# Altium schematic sheet P5650.925_SchematicSheet1.SchDoc
size A3; SheetNumber: 2; SheetTotal: 3
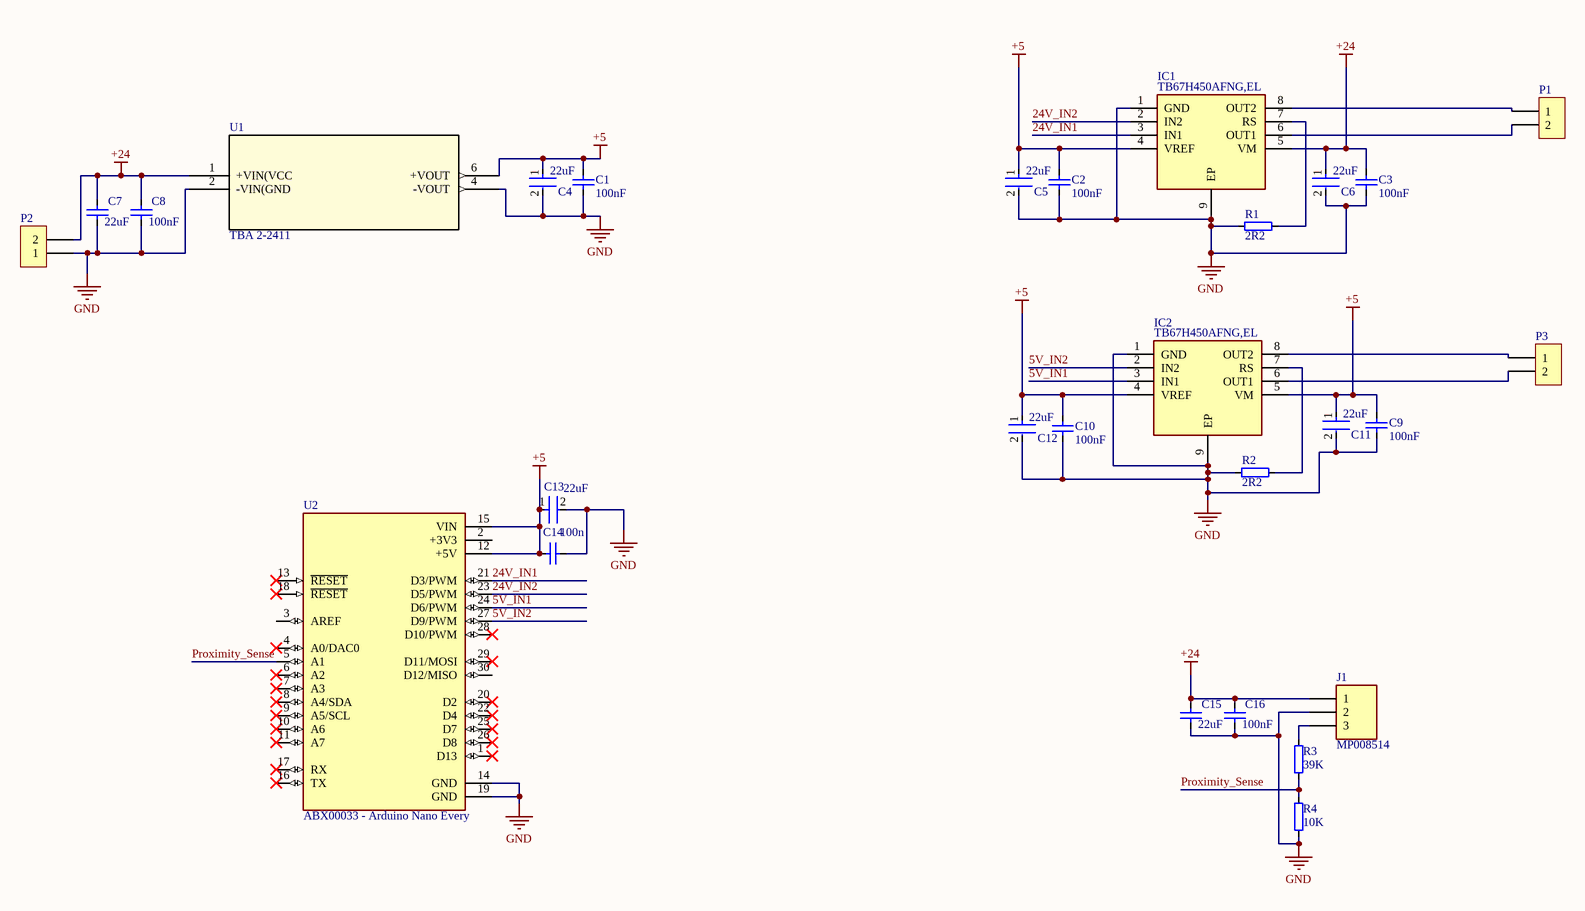
[diagram p0: P5650.925_SchematicSheet1.SchDoc]

## Parts
C1  value 100nF  [0603C]  (hidden comment: CAP 100n 10% 16V 0603 C X7R)
C2  value 100nF  [0603C]  (hidden comment: CAP 100n 10% 16V 0603 C X7R)
C3  value 100nF  [0603C Full Silk]  (hidden comment: CAP 100n 10% 50V 0603 X7R)
C4  22uF  [FP-C2012-125-0_2-IPC_A]
C5  22uF  [FP-C2012-125-0_2-IPC_A]
C6  22uF  [FP-C2012-125-0_2-IPC_A]
C7  value 22uF  [1210C]  (hidden comment: CAP 22u 20% 25V 1210 X7R)
C8  value 100nF  [0603C]  (hidden comment: CAP 100n 10% 16V 0603 C X7R)
C9  value 100nF  [0603C]  (hidden comment: CAP 100n 10% 16V 0603 C X7R)
C10  value 100nF  [0603C]  (hidden comment: CAP 100n 10% 16V 0603 C X7R)
C11  22uF  [FP-C2012-125-0_2-IPC_A]
C12  22uF  [FP-C2012-125-0_2-IPC_A]
C13  22uF  [FP-C2012-125-0_2-IPC_A]
C14  value 100n  [0603C]  (hidden comment: CAP 100n 10% 16V 0603 C X7R)
C15  value 22uF  [1210C]  (hidden comment: CAP 22u 20% 25V 1210 X7R)
C16  value 100nF  [0603C]  (hidden comment: CAP 100n 10% 16V 0603 C X7R)
IC1  TB67H450AFNG,EL  [TB67H450AFNG,EL -Motor driver-Footprint-1]
IC2  TB67H450AFNG,EL  [TB67H450AFNG,EL -Motor driver-Footprint-1]
J1  MP008514  [3 Way Screw terminal block - MP008514-Footprint-1]
P1  Con 2Way 3.81mm Screw Terminal  [Con 2Way 3.81mm Screw Terminal-Footprint-1]  (value not drawn)
P2  Con 2Way 3.81mm Screw Terminal  [Con 2Way 3.81mm Screw Terminal-Footprint-1]  (value not drawn)
P3  Con 2Way 3.81mm Screw Terminal  [Con 2Way 3.81mm Screw Terminal-Footprint-1]  (value not drawn)
R1  value 2R2  [2010/2512R]  (hidden comment: RES 2R2 5% 1W 2012 TK 200p)
R2  value 2R2  [2010/2512R]  (hidden comment: RES 2R2 5% 1W 2012 TK 200p)
R3  value 39K  [0603R]  (hidden comment: RES 39k 1% 0.1W 0603)
R4  value 10K  [0603R_IS]  (hidden comment: RES 10K 1% 0.1W 0603)
U1  TBA 2-2411  [TBA 2_SINGLE_TRP]
U2  ABX00033 - Arduino Nano Every  [MODULE_ABX00028]

## Nets
+5: C1.2 C2.2 C4.1 C5.1 C9.2 C10.2 C11.1 C12.1 C13.1 C14.2 IC1.4(VREF) IC2.4(VREF) IC2.5(VM) U1.6(+VOUT) U2.12(+5V) U2.15(VIN)
+24: C3.2 C6.1 C7.2 C8.2 C15.2 C16.2 IC1.5(VM) J1.1 P2.2 U1.1(+VIN(VCC)
GND: C1.1 C2.1 C3.1 C4.2 C5.2 C6.2 C7.1 C8.1 C9.1 C10.1 C11.2 C12.2 C13.2 C14.1 C15.1 C16.1 IC1.1(GND) IC1.9(EP) IC2.1(GND) IC2.9(EP) J1.2 P2.1 R1.1 R2.1 R4.1 U1.2(-VIN(GND) U1.4(-VOUT) U2.14(GND) U2.19(GND)
5V_IN1: IC2.3(IN1) U2.24(D6/PWM)
5V_IN2: IC2.2(IN2) U2.27(D9/PWM)
24V_IN1: IC1.3(IN1) U2.21(D3/PWM)
24V_IN2: IC1.2(IN2) U2.23(D5/PWM)
Proximity_Sense: R3.2 R4.2 U2.5(A1)
NetIC1_6: IC1.6(OUT1) P1.2
NetIC1_7: IC1.7(RS) R1.2
NetIC1_8: IC1.8(OUT2) P1.1
NetIC2_6: IC2.6(OUT1) P3.2
NetIC2_7: IC2.7(RS) R2.2
NetIC2_8: IC2.8(OUT2) P3.1
NetJ1_3: J1.3 R3.1

Not connected (* = marked no-connect by the designer): U2 1(D13)* 2(+3V3) 3(AREF) 4(A0/DAC0)* 6(A2)* 7(A3)* 8(A4/SDA)* 9(A5/SCL)* 10(A6)* 11(A7)* 13(~{RESET})* 16(TX)* 17(RX)* 18(~{RESET})* 20(D2)* 22(D4)* 25(D7)* 26(D8)* 28(D10/PWM)* 29(D11/MOSI)* 30(D12/MISO)

## Notes on the sheet
- Client / Project
- Issue
- ECR
- Number
- Title
- Date
- App'd
- Sheet
- Must Not Be Modified
- Without Authorisation
- Certification Drawing
- Values shown are typical, see BOM table for certification details
- !
- DENOTES SAFETY COMPONENT
- Dr'n
- TROLEX Ltd
- Newby Road, Stockport, Cheshire SK7 5DY  U.K.
- Ch'kd
- Tel: +44 (0)161-483-1435  Web:www.trolex.com  Email: info@trolex.com
- No.
- Of

## Library data of the parts
C1 C2 C8-C10 C14 C16 = CMP-001-00021-1: Part Number: S890.0055; Certification Footprint: 0603; Certification Field 3: nF; Certification Field 1: Capacitor
C3 = CMP-001-00005-4: CAP 100n 10% 50V 0603 C X7R; Part Number: S890.0090; Certification Field 5: 200; Certification Footprint: 0603; Certification Field 1: Capacitor; Certification Field 2: 100; Certification Field 3: nF; Certification Field 7: 0603
C4-C6 C11-C13 = CMP-00037-1: Ceramic Capacitor, Multilayer, Ceramic, 35V, 20% +Tol, 20% -Tol, X5R, 15% TC, 22uF, Surface Mount, 0805; Part number: PART NOT IN NAV; Max Operating Temperature: 85°C; Reach SVHC Compliant: Yes; Capacitance: 22uF; Capacitor Type: Ceramic; RoHS Compliant: Yes; Min Operating Temperature: -55°C; Temperature Characteristics Code: X5R
C7 C15 = CMP-001-00041-1: CAP 22u 20% 25V 1210 C X7R; Part Number: S890.0116; Certification Footprint: 1210; Certification Field 1: Capacitor; Certification Field 3: nF
IC1 IC2 = CMP-00024-00000-1: Motor / Motion / Ignition Controllers & Drivers MOTOR DRIVER IC 50V 3.5A; Part number: PART NOT IN NAV; Voltage Rating: 44V; Max Operating Temperature: 85°C; RoHS Compliant: Yes; Min Operating Temperature: 40°C; Pins: 8; Mounting Technology: Surface mount; Case/Package: 8-SOIC
J1 = CMP-002-00036-1: Tb, Wire To Brd, R/A, 3Way, 18Awg Rohs Compliant: Yes; Part number: PART NOT IN NAV; Gender: Female; Mounting Technology: Through hole; RoHS Compliant: Yes; Max Operating Temperature: 105°C; Min Operating Temperature: -40°C; Pins: 3
P1-P3 = CMP-002-00008-1: Molex KK Header 2.54mm 171856-0004; Part Number: NOT IN NAV
R1 R2 = CMP-009-00228-2: Part Number: S144.0349; Certification Field 3: R; Certification Footprint: 2010; Certification Field 6: 1W; Certification Field 7: 2010; Certification Field 1: Resistor
R3 = CMP-009-00086-3: RES 39k 1% 0.1W 0603 C 100p; Part Number: S144.0357; Certification Field 3: R; Certification Footprint: 0603; Certification Field 8: or 0R Link or Not Fitted; Certification Field 1: Resistor; Certification Field 7: 0603; Certification Field 6: 0.1W
R4 = CMP-009-00003-6: RES 10K 1% 0.1W 0603 TK 100p; Part Number: S108.0103; Certification Field 8: Or 0R Link or Not Fitted; Certification Field 7: 0603; Certification Field 3: R; Certification Field 1: Resistor; Certification Footprint: 0603; Certification Field 6: 0.1W
U1 = CMP-00054-1: DC-DC Converter; SIP; 2W; Out 1 (Vdc); 5; Out 2 (Vdc); Out 3 (Vdc); Part number: PART NOT ON NAV; Number of Circuits: 1; Nominal Output Voltage: 5V; Nominal Input Voltage: 24V; Max Output Current: 400mA; Efficiency: 78%; Min Output Voltage: 4.85V; Max Output Voltage: 5.15V; Max Input Voltage: 26.4V; Min Input Voltage: 21.6V; Terminal Pitch: 2.54mm; Width: 7.6mm; Max Operating Temperature: 90°C; Number of Outputs: 1; Number of Terminals: 5; Lifecycle Status: Production; REACH SVHC: No; Min Operating Temperature: -40°C; Max Output Power: 2W; Height - Seated (Max): 10.55mm; RoHS: Compliant; Length: 19.55mm
U2 = CMP-451-000000-2: Arduino Nano Every; Part number: Part not in NAV; MP: Arduino Nano Every; MF: Arduino; Component Type: Standard; Package: None; Pin Count: 30; Design Item ID: ABX00033; Source: ABX00028.SchLib; Value: *; Price: None